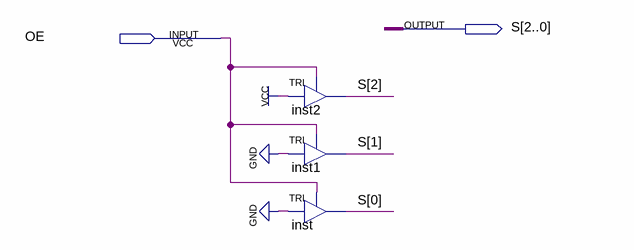
[diagram p0: schematic sheet]
// Quartus schematic OE_Controller_Design.bdf as structural Verilog: 3 symbols, 2 pins
module OE_Controller_Design (
  input  OE,
  output [2:0] S
);

  TRI inst2 (.IN(1'b1), .OE(OE), .OUT(S[2]));
  TRI inst1 (.IN(1'b0), .OE(OE), .OUT(S[1]));
  TRI inst (.IN(1'b0), .OE(OE), .OUT(S[0]));
endmodule
